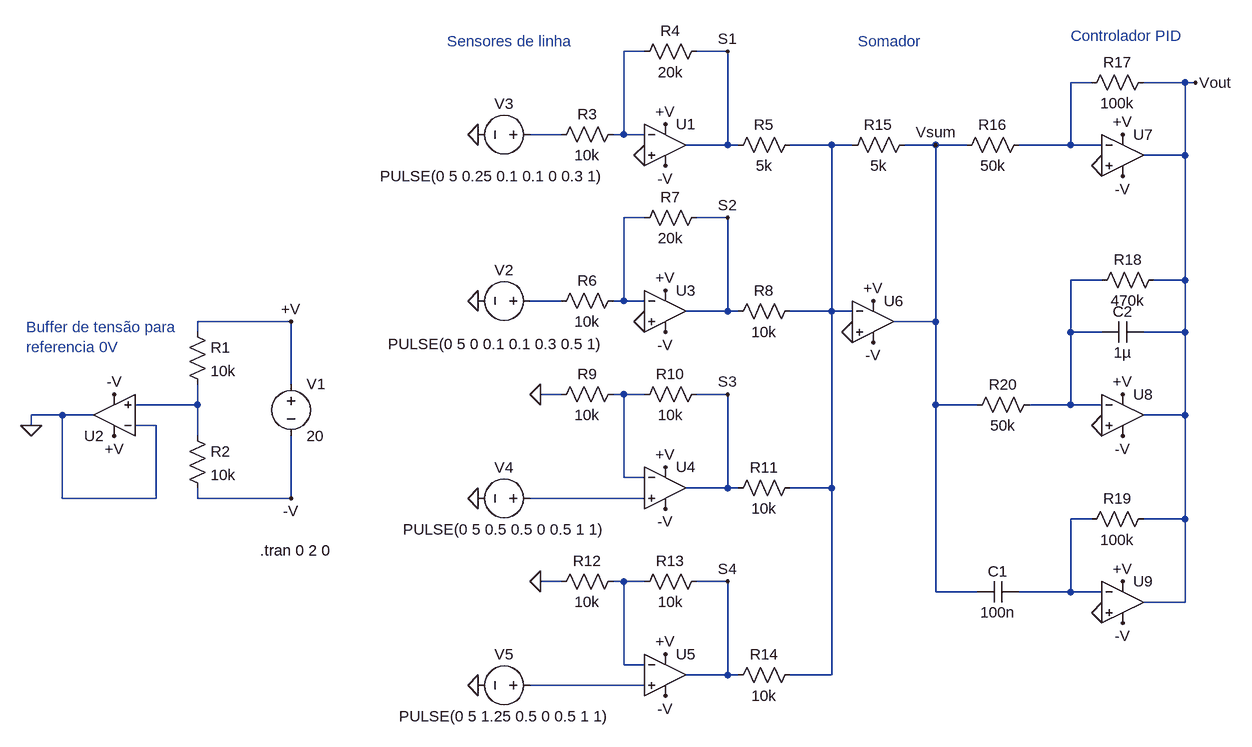
[diagram p0: schematic Sensores_de_linha.asc]
Sensores_de_linha.asc, the LTspice schematic file:
Version 4
SHEET 1 1420 824
WIRE 272 -240 240 -240
WIRE 400 -240 352 -240
WIRE 960 -192 928 -192
WIRE 1104 -192 1040 -192
WIRE 1120 -192 1104 -192
WIRE 144 -112 96 -112
WIRE 240 -112 240 -240
WIRE 240 -112 224 -112
WIRE 272 -112 240 -112
WIRE 400 -96 400 -240
WIRE 400 -96 336 -96
WIRE 416 -96 400 -96
WIRE 560 -96 496 -96
WIRE 592 -96 560 -96
WIRE 720 -96 672 -96
WIRE 768 -96 720 -96
WIRE 928 -96 928 -192
WIRE 928 -96 848 -96
WIRE 976 -96 928 -96
WIRE 1104 -80 1104 -192
WIRE 1104 -80 1040 -80
WIRE 272 16 240 16
WIRE 400 16 352 16
WIRE 976 112 928 112
WIRE 1104 112 1104 -80
WIRE 1104 112 1056 112
WIRE 144 144 96 144
WIRE 240 144 240 16
WIRE 240 144 224 144
WIRE 272 144 240 144
WIRE 400 160 400 16
WIRE 400 160 336 160
WIRE 416 160 400 160
WIRE 560 160 560 -96
WIRE 560 160 496 160
WIRE 592 160 560 160
WIRE -272 176 -416 176
WIRE 720 176 720 -96
WIRE 720 176 656 176
WIRE -416 192 -416 176
WIRE 928 192 928 112
WIRE 976 192 928 192
WIRE 1104 192 1104 112
WIRE 1104 192 1040 192
WIRE -272 272 -272 176
WIRE 144 288 112 288
WIRE 240 288 224 288
WIRE 272 288 240 288
WIRE 400 288 352 288
WIRE -416 304 -416 272
WIRE -416 304 -512 304
WIRE 720 304 720 176
WIRE 784 304 720 304
WIRE 928 304 928 192
WIRE 928 304 864 304
WIRE 976 304 928 304
WIRE -624 320 -672 320
WIRE -576 320 -624 320
WIRE 1104 320 1104 192
WIRE 1104 320 1040 320
WIRE -672 336 -672 320
WIRE -480 336 -512 336
WIRE -416 352 -416 304
WIRE 240 416 240 288
WIRE 272 416 240 416
WIRE 400 432 400 288
WIRE 400 432 336 432
WIRE 416 432 400 432
WIRE 560 432 560 160
WIRE 560 432 496 432
WIRE -624 448 -624 320
WIRE -480 448 -480 336
WIRE -480 448 -624 448
WIRE -416 448 -416 432
WIRE -272 448 -272 352
WIRE -272 448 -416 448
WIRE 272 448 96 448
WIRE 960 480 928 480
WIRE 1104 480 1104 320
WIRE 1104 480 1040 480
WIRE 144 576 112 576
WIRE 240 576 224 576
WIRE 272 576 240 576
WIRE 400 576 352 576
WIRE 720 592 720 304
WIRE 784 592 720 592
WIRE 928 592 928 480
WIRE 928 592 848 592
WIRE 976 592 928 592
WIRE 1104 608 1104 480
WIRE 1104 608 1040 608
WIRE 240 704 240 576
WIRE 272 704 240 704
WIRE 400 720 400 576
WIRE 400 720 336 720
WIRE 416 720 400 720
WIRE 560 720 560 432
WIRE 560 720 496 720
WIRE 272 736 96 736
FLAG -272 448 -V
FLAG -272 176 +V
FLAG -672 336 0
FLAG -544 288 -V
FLAG -544 352 +V
FLAG 304 -64 -V
FLAG 304 -128 +V
FLAG 304 192 -V
FLAG 304 128 +V
FLAG 272 176 0
FLAG 272 -80 0
FLAG 304 464 -V
FLAG 304 400 +V
FLAG 112 288 0
FLAG 304 752 -V
FLAG 304 688 +V
FLAG 112 576 0
FLAG 624 208 -V
FLAG 624 144 +V
FLAG 592 192 0
FLAG 1120 -192 Vout
FLAG 16 736 0
FLAG 16 448 0
FLAG 16 144 0
FLAG 16 -112 0
FLAG 1008 -48 -V
FLAG 1008 -112 +V
FLAG 976 -64 0
FLAG 1008 352 -V
FLAG 1008 288 +V
FLAG 976 336 0
FLAG 1008 640 -V
FLAG 1008 576 +V
FLAG 976 624 0
FLAG 720 -96 Vsum
FLAG 400 -240 S1
FLAG 400 16 S2
FLAG 400 288 S3
FLAG 400 576 S4
SYMBOL OpAmps\\UniversalOpAmp2 304 -96 R0
SYMATTR InstName U1
SYMBOL OpAmps\\UniversalOpAmp2 -544 320 R180
SYMATTR InstName U2
SYMBOL voltage -272 256 R0
WINDOW 123 0 0 Left 0
WINDOW 39 0 0 Left 0
SYMATTR InstName V1
SYMATTR Value 20
SYMBOL res -432 176 R0
SYMATTR InstName R1
SYMATTR Value 10k
SYMBOL res -432 336 R0
SYMATTR InstName R2
SYMATTR Value 10k
SYMBOL res 240 -128 R90
WINDOW 0 0 56 VBottom 2
WINDOW 3 32 56 VTop 2
SYMATTR InstName R3
SYMATTR Value 10k
SYMBOL res 368 -256 R90
WINDOW 0 0 56 VBottom 2
WINDOW 3 32 56 VTop 2
SYMATTR InstName R4
SYMATTR Value 20k
SYMBOL res 512 -112 R90
WINDOW 0 0 56 VBottom 2
WINDOW 3 32 56 VTop 2
SYMATTR InstName R5
SYMATTR Value 5k
SYMBOL OpAmps\\UniversalOpAmp2 304 160 R0
SYMATTR InstName U3
SYMBOL res 240 128 R90
WINDOW 0 0 56 VBottom 2
WINDOW 3 32 56 VTop 2
SYMATTR InstName R6
SYMATTR Value 10k
SYMBOL res 368 0 R90
WINDOW 0 0 56 VBottom 2
WINDOW 3 32 56 VTop 2
SYMATTR InstName R7
SYMATTR Value 20k
SYMBOL OpAmps\\UniversalOpAmp2 304 432 R0
SYMATTR InstName U4
SYMBOL res 240 272 R90
WINDOW 0 0 56 VBottom 2
WINDOW 3 32 56 VTop 2
SYMATTR InstName R9
SYMATTR Value 10k
SYMBOL res 368 272 R90
WINDOW 0 0 56 VBottom 2
WINDOW 3 32 56 VTop 2
SYMATTR InstName R10
SYMATTR Value 10k
SYMBOL OpAmps\\UniversalOpAmp2 304 720 R0
SYMATTR InstName U5
SYMBOL res 240 560 R90
WINDOW 0 0 56 VBottom 2
WINDOW 3 32 56 VTop 2
SYMATTR InstName R12
SYMATTR Value 10k
SYMBOL res 368 560 R90
WINDOW 0 0 56 VBottom 2
WINDOW 3 32 56 VTop 2
SYMATTR InstName R13
SYMATTR Value 10k
SYMBOL res 512 704 R90
WINDOW 0 0 56 VBottom 2
WINDOW 3 32 56 VTop 2
SYMATTR InstName R14
SYMATTR Value 10k
SYMBOL OpAmps\\UniversalOpAmp2 624 176 R0
SYMATTR InstName U6
SYMBOL voltage 112 144 R90
WINDOW 0 -32 56 VBottom 2
WINDOW 3 51 69 VTop 2
WINDOW 123 0 0 Left 0
WINDOW 39 0 0 Left 0
SYMATTR InstName V2
SYMATTR Value PULSE(0 5 0 0.1 0.1 0.3 0.5 1)
SYMBOL voltage 112 -112 R90
WINDOW 0 -32 56 VBottom 2
WINDOW 3 48 75 VTop 2
WINDOW 123 0 0 Left 0
WINDOW 39 0 0 Left 0
SYMATTR InstName V3
SYMATTR Value PULSE(0 5 0.25 0.1 0.1 0 0.3 1)
SYMBOL voltage 112 448 R90
WINDOW 0 -32 56 VBottom 2
WINDOW 3 32 56 VTop 2
WINDOW 123 0 0 Left 0
WINDOW 39 0 0 Left 0
SYMATTR InstName V4
SYMATTR Value PULSE(0 5 0.5 0.5 0 0.5 1 1)
SYMBOL voltage 112 736 R90
WINDOW 0 -32 56 VBottom 2
WINDOW 3 32 56 VTop 2
WINDOW 123 0 0 Left 0
WINDOW 39 0 0 Left 0
SYMATTR InstName V5
SYMATTR Value PULSE(0 5 1.25 0.5 0 0.5 1 1)
SYMBOL res 512 144 R90
WINDOW 0 0 56 VBottom 2
WINDOW 3 32 56 VTop 2
SYMATTR InstName R8
SYMATTR Value 10k
SYMBOL res 512 416 R90
WINDOW 0 0 56 VBottom 2
WINDOW 3 32 56 VTop 2
SYMATTR InstName R11
SYMATTR Value 10k
SYMBOL res 688 -112 R90
WINDOW 0 0 56 VBottom 2
WINDOW 3 32 56 VTop 2
SYMATTR InstName R15
SYMATTR Value 5k
SYMBOL OpAmps\\UniversalOpAmp2 1008 -80 R0
SYMATTR InstName U7
SYMBOL OpAmps\\UniversalOpAmp2 1008 320 R0
SYMATTR InstName U8
SYMBOL OpAmps\\UniversalOpAmp2 1008 608 R0
SYMATTR InstName U9
SYMBOL res 864 -112 R90
WINDOW 0 0 56 VBottom 2
WINDOW 3 32 56 VTop 2
SYMATTR InstName R16
SYMATTR Value 50k
SYMBOL res 1056 -208 R90
WINDOW 0 0 56 VBottom 2
WINDOW 3 32 56 VTop 2
SYMATTR InstName R17
SYMATTR Value 100k
SYMBOL cap 848 576 R90
WINDOW 0 0 32 VBottom 2
WINDOW 3 32 32 VTop 2
SYMATTR InstName C1
SYMATTR Value 100n
SYMBOL cap 1040 176 R90
WINDOW 0 0 32 VBottom 2
WINDOW 3 32 32 VTop 2
SYMATTR InstName C2
SYMATTR Value 1µ
SYMBOL res 1072 96 R90
WINDOW 0 0 56 VBottom 2
WINDOW 3 32 56 VTop 2
SYMATTR InstName R18
SYMATTR Value 470k
SYMBOL res 1056 464 R90
WINDOW 0 0 56 VBottom 2
WINDOW 3 32 56 VTop 2
SYMATTR InstName R19
SYMATTR Value 100k
SYMBOL res 880 288 R90
WINDOW 0 0 56 VBottom 2
WINDOW 3 32 56 VTop 2
SYMATTR InstName R20
SYMATTR Value 50k
TEXT -320 528 Left 2 !.tran 0 2 0
TEXT -680 184 Left 2 ;Buffer de tensão para \nreferencia 0V
TEXT -32 -256 Left 2 ;Sensores de linha
TEXT 600 -256 Left 2 ;Somador
TEXT 928 -264 Left 2 ;Controlador PID

The netlist it stands for:
* Sensores_de_linha.asc
XU1 0 N001 +V -V S1 level2 Avol=1Meg GBW=10Meg Slew=10Meg Ilimit=25m Rail=0 Vos=0 En=0 Enk=0 In=0 Ink=0 Rin=500Meg  ; pins In+ In- V+ V- OUT
XU2 N009 0 +V -V 0 level2 Avol=1Meg GBW=10Meg Slew=10Meg Ilimit=25m Rail=0 Vos=0 En=0 Enk=0 In=0 Ink=0 Rin=500Meg  ; pins In+ In- V+ V- OUT
V1 +V -V 20
R1 +V N009 10k
R2 N009 -V 10k
R3 N001 N003 10k
R4 S1 N001 20k
R5 N004 S1 5k
XU3 0 N005 +V -V S2 level2 Avol=1Meg GBW=10Meg Slew=10Meg Ilimit=25m Rail=0 Vos=0 En=0 Enk=0 In=0 Ink=0 Rin=500Meg  ; pins In+ In- V+ V- OUT
R6 N005 N007 10k
R7 S2 N005 20k
XU4 N010 N008 +V -V S3 level2 Avol=1Meg GBW=10Meg Slew=10Meg Ilimit=25m Rail=0 Vos=0 En=0 Enk=0 In=0 Ink=0 Rin=500Meg  ; pins In+ In- V+ V- OUT
R9 N008 0 10k
R10 S3 N008 10k
XU5 N013 N012 +V -V S4 level2 Avol=1Meg GBW=10Meg Slew=10Meg Ilimit=25m Rail=0 Vos=0 En=0 Enk=0 In=0 Ink=0 Rin=500Meg  ; pins In+ In- V+ V- OUT
R12 N012 0 10k
R13 S4 N012 10k
R14 N004 S4 10k
XU6 0 N004 +V -V Vsum level2 Avol=1Meg GBW=10Meg Slew=10Meg Ilimit=25m Rail=0 Vos=0 En=0 Enk=0 In=0 Ink=0 Rin=500Meg  ; pins In+ In- V+ V- OUT
V2 N007 0 PULSE(0 5 0 0.1 0.1 0.3 0.5 1)
V3 N003 0 PULSE(0 5 0.25 0.1 0.1 0 0.3 1)
V4 N010 0 PULSE(0 5 0.5 0.5 0 0.5 1 1)
V5 N013 0 PULSE(0 5 1.25 0.5 0 0.5 1 1)
R8 N004 S2 10k
R11 N004 S3 10k
R15 Vsum N004 5k
XU7 0 N002 +V -V Vout level2 Avol=1Meg GBW=10Meg Slew=10Meg Ilimit=25m Rail=0 Vos=0 En=0 Enk=0 In=0 Ink=0 Rin=500Meg  ; pins In+ In- V+ V- OUT
XU8 0 N006 +V -V Vout level2 Avol=1Meg GBW=10Meg Slew=10Meg Ilimit=25m Rail=0 Vos=0 En=0 Enk=0 In=0 Ink=0 Rin=500Meg  ; pins In+ In- V+ V- OUT
XU9 0 N011 +V -V Vout level2 Avol=1Meg GBW=10Meg Slew=10Meg Ilimit=25m Rail=0 Vos=0 En=0 Enk=0 In=0 Ink=0 Rin=500Meg  ; pins In+ In- V+ V- OUT
R16 N002 Vsum 50k
R17 Vout N002 100k
C1 N011 Vsum 100n
C2 Vout N006 1µ
R18 Vout N006 470k
R19 Vout N011 100k
R20 N006 Vsum 50k
.tran 0 2 0
* Buffer de tensão para
* referencia 0V
* Sensores de linha
* Somador
* Controlador PID
.lib UniversalOpAmp2.lib
.backanno
.end

* Results of the author's LTspice run, read from the files saved beside the schematic
* Operating Point, zero values left out:
*   V(+v) = 10 V
*   V(-v) = -10 V
*   I(R1) = 1 mA
*   I(R2) = 1 mA
*   I(V1) = -9.996 mA
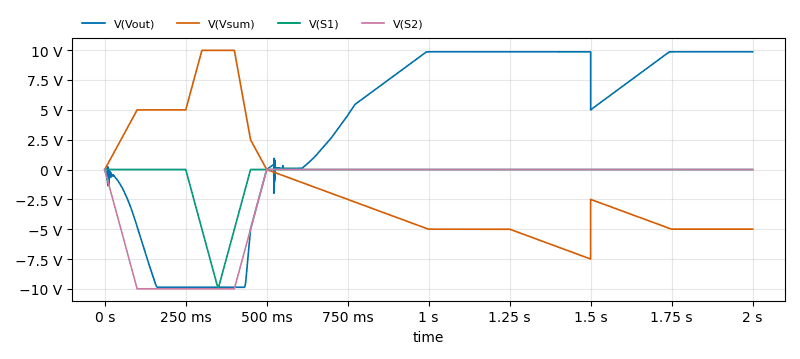
[diagram p1: Transient Analysis of Sensores_de_linha.asc, plotted from the saved traces]
* Transient Analysis, 1 run:
*   V(Vout): min -9.857 V, max 9.857 V, average 3.943 V, rms 8.206 V, last 9.855 V
*   V(Vsum): min -7.491 V, max 9.977 V, average -1.749 V, rms 4.994 V, last -4.991 V
*   V(S1): min -9.974 V, max 34.04 µV, average -500 mV, rms 1.826 V, last 0 V
*   V(S2): min -9.984 V, max 17 µV, average -1.997 V, rms 4.276 V, last 0 V